# Altium project Gas_Sensor.PrjPcb
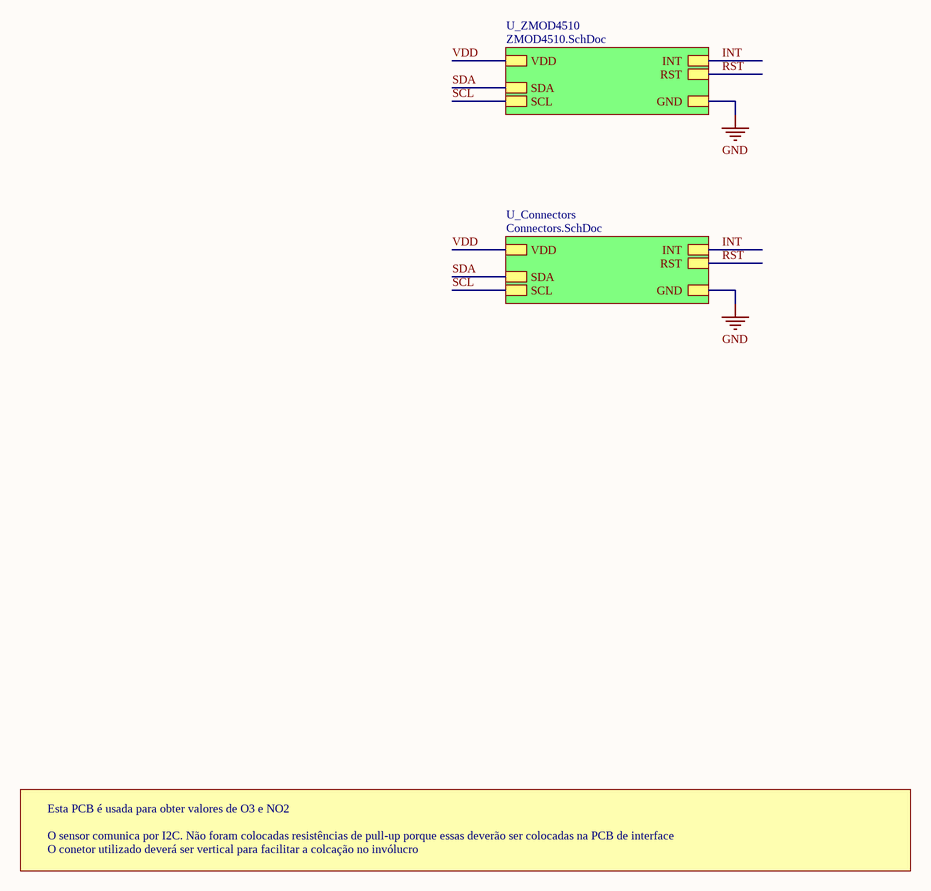
[diagram p0: Gas_Sensor.SchDoc]
3 sheets, 8 parts. Net scope: hierarchical (ports join the sheet entries above them; power ports are global).
Board file: Gas_Sensor.PcbDoc
Sheets:
  Gas_Sensor.SchDoc
    U_Connectors = Connectors.SchDoc
    U_ZMOD4510 = ZMOD4510.SchDoc

## Sheet Gas_Sensor.SchDoc: Gas Sensor Main Schematic
size A4; DrawnBy: Flávio Silva; Engineer: Flávio Silva; Organization: CeNTI; Address1: Rua Fernando Mesquita 2785; Address2: Vila Nova de Famalicão; Address3: 4760-034, Portugal; Revision: 0; SheetNumber: 1; SheetTotal: 3; Project: AM2R- Safe2Wheels

### Sub-sheets
U_Connectors = Connectors.SchDoc: VDD, SCL, SDA, INT, GND, RST
U_ZMOD4510 = ZMOD4510.SchDoc: VDD, SCL, SDA, INT, GND, RST

### Nets
GND: sheet U_Connectors/GND, sheet U_ZMOD4510/GND
INT: sheet U_Connectors/INT, sheet U_ZMOD4510/INT
RST: sheet U_Connectors/RST, sheet U_ZMOD4510/RST
SCL: sheet U_Connectors/SCL, sheet U_ZMOD4510/SCL
SDA: sheet U_Connectors/SDA, sheet U_ZMOD4510/SDA
VDD: sheet U_Connectors/VDD, sheet U_ZMOD4510/VDD

### Notes on the sheet
- Esta PCB é usada para obter valores de O3 e NO2
- O sensor comunica por I2C. Não foram colocadas resistências de pull-up porque essas deverão ser colocadas na PCB de interface
- O conetor utilizado deverá ser vertical para facilitar a colcação no invólucro
- Title:
- Project:
- Date:
- Rev:
- Sheet
- of
- Author:

## Sheet Connectors.SchDoc: Connectors
size A4; DrawnBy: Flávio Silva; Engineer: Flávio Silva; Organization: CeNTI; Address1: Rua Fernando Mesquita 2785; Address2: Vila Nova de Famalicão; Address3: 4760-034, Portugal; Revision: 0; SheetNumber: 2; SheetTotal: 3; Project: AM2R- Safe2Wheels
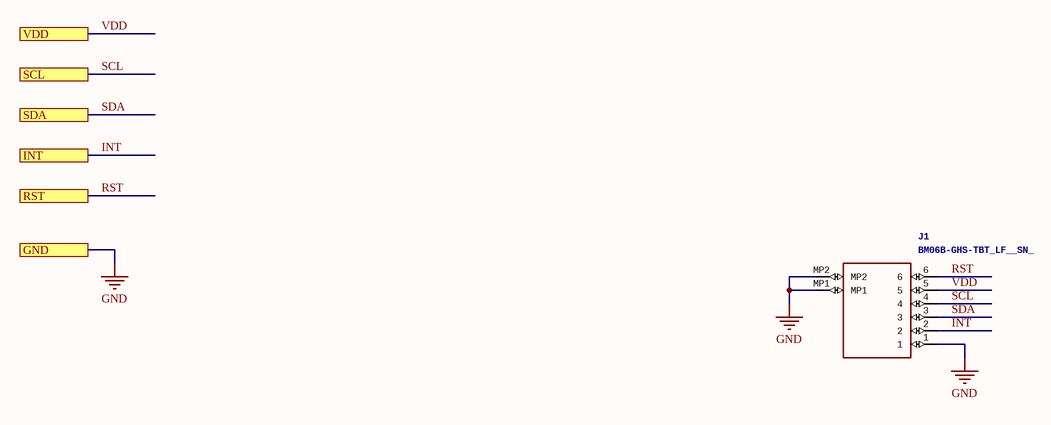
[diagram p1: Connectors.SchDoc]

### Parts
J1  BM06B-GHS-TBT_LF__SN_  [BM06BGHSTBTLFSN]

### Ports
GND, INT, RST, SCL, SDA, VDD

### Nets
GND: J1.1 J1.MP1 J1.MP2 ; port GND
INT: J1.2 ; port INT
RST: J1.6 ; port RST
SCL: J1.4 ; port SCL
SDA: J1.3 ; port SDA
VDD: J1.5 ; port VDD

### Notes on the sheet
- Title:
- Project:
- Date:
- Rev:
- Sheet
- of
- Author:

### Library data of the parts
J1 = BM06B-GHS-TBT_LF__SN_: BM06B Series 6 Position 1.25 mm Pitch Surface Mount Top Entry Shrouded Header   Source:  Datasheet; Manufacturer_Name: JST (JAPAN SOLDERLESS TERMINALS); Manufacturer_Part_Number: BM06B-GHS-TBT(LF)(SN); GateName_1: G$1; SymbolName_1: BM06B-GHS-TBT_LF__SN_; LibraryName: BM06B-GHS-TBT_LF__SN_; DeviceSetName: BM06B-GHS-TBT_LF__SN_; Height: 4.05mm

## Sheet ZMOD4510.SchDoc: ZMOD4510
size A4; DrawnBy: Flávio Silva; Engineer: Flávio Silva; Organization: CeNTI; Address1: Rua Fernando Mesquita 2785; Address2: Vila Nova de Famalicão; Address3: 4760-034, Portugal; Revision: 0; SheetNumber: 3; SheetTotal: 3; Project: AM2R- Safe2Wheels
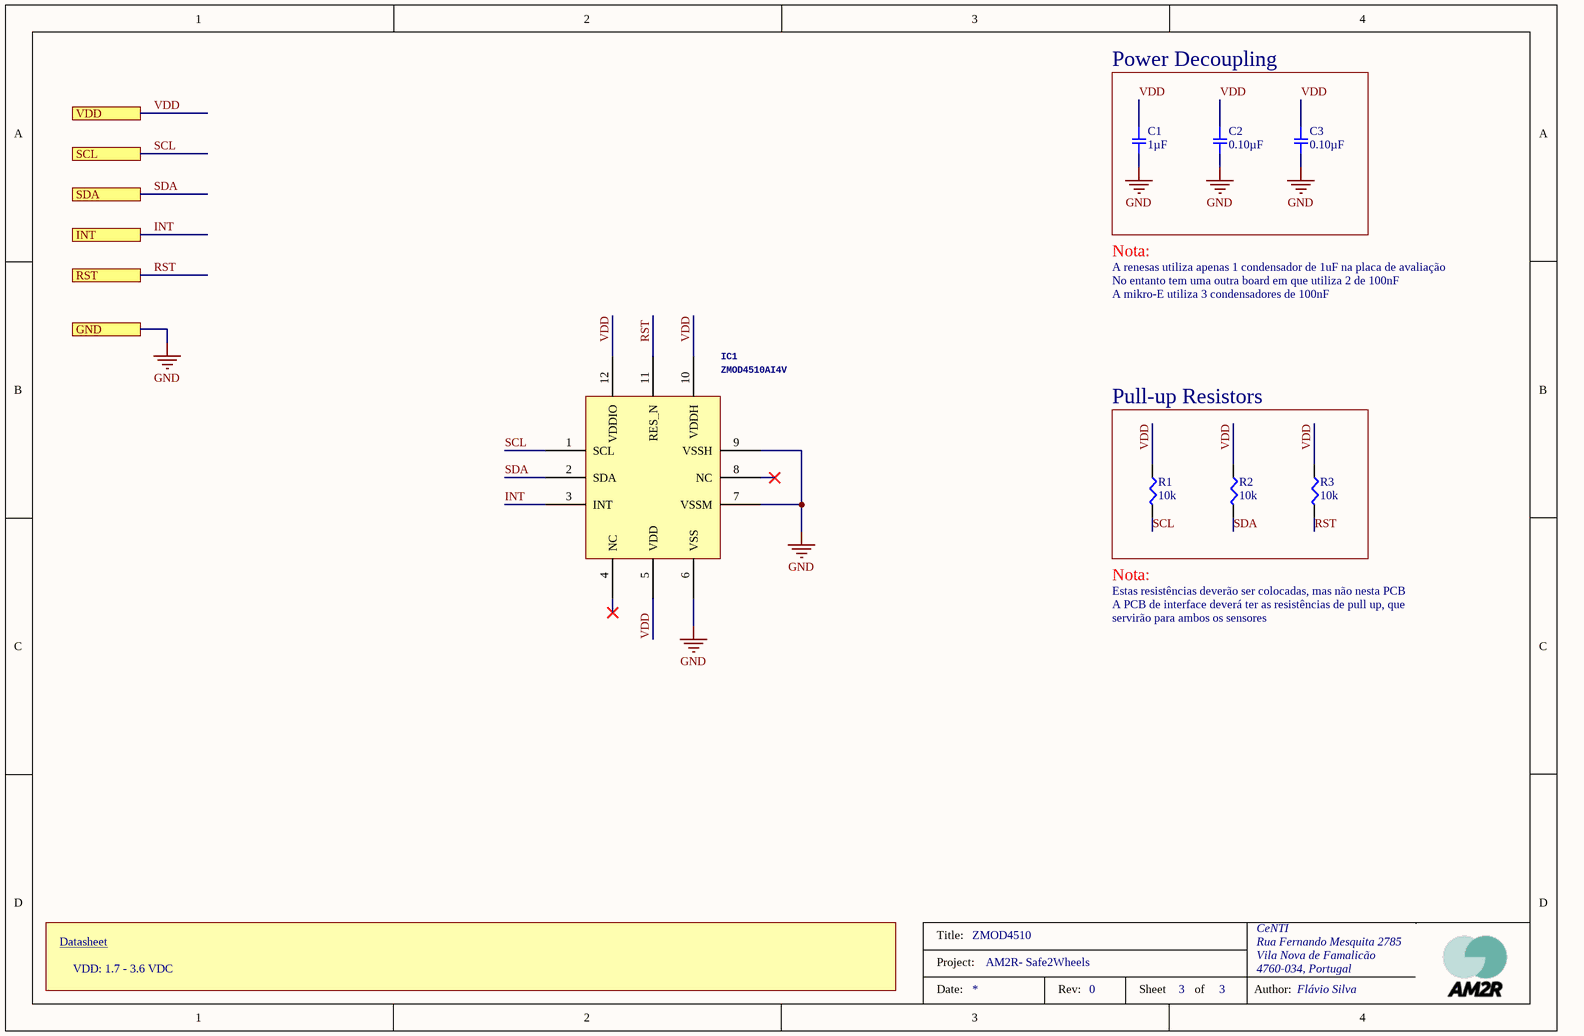
[diagram p2: ZMOD4510.SchDoc]

### Parts
C1  1µF  [SMD-0402C]
C2  0.10µF  [SMD-0402C]
C3  0.10µF  [SMD-0402C]
IC1  ZMOD4510AI4V  [ZMOD4xxx_AI4_IP67]
R1  10k  [SMD-0402-RES]
R2  10k  [SMD-0402-RES]
R3  10k  [SMD-0402-RES]

### Blocks framed on the sheet
Power Decoupling: C1-C3
Pull-up Resistors: R1-R3

### Ports
GND, INT, RST, SCL, SDA, VDD

### Nets
GND: C1.2 C2.2 C3.2 IC1.6(VSS) IC1.7(VSSM) IC1.9(VSSH) ; port GND
INT: IC1.3(INT) ; port INT
RST: IC1.11(RES_N) R3.2 ; port RST
SCL: IC1.1(SCL) R1.2 ; port SCL
SDA: IC1.2(SDA) R2.2 ; port SDA
VDD: C1.1 C2.1 C3.1 IC1.5(VDD) IC1.10(VDDH) IC1.12(VDDIO) R1.1 R2.1 R3.1 ; port VDD

Not connected (* = marked no-connect by the designer): IC1 4(NC)* 8(NC)*

### Notes on the sheet
- Nota:
- A renesas utiliza apenas 1 condensador de 1uF na placa de avaliação
- No entanto tem uma outra board em que utiliza 2 de 100nF
- A mikro-E utiliza 3 condensadores de 100nF
- Estas resistências deverão ser colocadas, mas não nesta PCB
- A PCB de interface deverá ter as resistências de pull up, que
- servirão para ambos os sensores
- Datasheet <https://www.renesas.com/us/en/document/dst/zmod4510-datasheet?r=463746>
- VDD: 1.7 - 3.6 VDC
- Title:
- Project:
- Date:
- Rev:
- Sheet
- of
- Author:

### Library data of the parts
C1 = GCM155C71A105KE38D: CAP CER 1UF 10V X7S 0402; Manufacturer: Murata Electronics North America; Factory Stock: 0; Unit Price (USD): 0.12; Minimum Quantity: 1; Tolerance: ±10%; Datasheets: http://www.murata.com/~/media/webrenewal/support/library/catalog/products/capacitor/mlcc/c03e.ashx; Image: //media.digikey.com/Renders/Murata%20Renders/ZRB-SERIES-0402.jpg; Digi-Key Part Number: 490-13409-1-ND; Part Number: GCM155C71A105KE38D; Quantity Available: 7240; @ qty: 0; Packaging: Cut Tape (CT); Series: GCM; Part Status: Active; Value: 1µF; Voltage: 10V; Temperature Coefficient: X7S; Operating Temperature: -55°C ~ 125°C; Features: -; Ratings: AEC-Q200; Applications: Automotive; Mounting Type: Surface Mount, MLCC; Package / Case: 0402 (1005 Metric); Size / Dimension: 0.039" L x 0.020" W (1.00mm x 0.50mm); Height - Seated (Max): -; Thickness (Max): 0.022" (0.55mm); Lead Spacing: -; Lead Style: -
C2 C3 = GCM155R71C104KA55D: CAP CER 0.1UF 16V X7R 0402; Manufacturer: Murata Electronics North America; Factory Stock: 0; Unit Price (USD): 0.1; Minimum Quantity: 1; Tolerance: ±10%; Datasheets: http://www.murata.com/~/media/webrenewal/support/library/catalog/products/capacitor/mlcc/c03e.ashx; Image: //media.digikey.com/Renders/Murata%20Renders/ZRB-SERIES-0402.jpg; Digi-Key Part Number: 490-4759-1-ND; Part Number: GCM155R71C104KA55D; Quantity Available: 734194; @ qty: 0; Packaging: Cut Tape (CT); Series: GCM; Part Status: Active; Value: 0.10µF; Voltage: 16V; Temperature Coefficient: X7R; Operating Temperature: -55°C ~ 125°C; Features: -; Ratings: AEC-Q200; Applications: Automotive; Mounting Type: Surface Mount, MLCC; Package / Case: 0402 (1005 Metric); Size / Dimension: 0.039" L x 0.020" W (1.00mm x 0.50mm); Height - Seated (Max): -; Thickness (Max): 0.022" (0.55mm); Lead Spacing: -; Lead Style: -
IC1 = ZMOD4510AI4V: The ZMOD4510 gas sensor platform detects air quality in a variety of indoor and outdoor applications. The module is a 12-pin LGA assembly (standard version 3.0mm x 3.0mm x 0.7mm) that consists of a gas sense element and a CMOS signal conditioning IC. The modules sense element consists of a heater element on a silicon-based MEMS structure and a metal-oxide (MOx) chemiresistor. The signal conditioner controls the sensor temperature and measures the MOx resistance, which is a function of the gas concentration   Source:  Datasheet; Manufacturer_Name: Renesas Electronics; GateName_1: G$1; SymbolName_1: ZMOD4510AI4V; LibraryName: ZMOD4510AI4V; DeviceSetName: ZMOD4510AI4V; Manufacturer_Part_Number: ZMOD4510AI4V; Mouser_Part_Number: 972-ZMOD4510AI4V; Mouser_Price-Stock: https://www.mouser.co.uk/ProductDetail/Renesas-Electronics/ZMOD4510AI4V?qs=DRkmTr78QARdQZKp0qnVWA%3D%3D; Height: 1mm
R1-R3 = ERJ-PA2F1002X: RES SMD 10K OHM 1% 1/5W 0402; Manufacturer: Panasonic Electronic Components; Factory Stock: 0; Unit Price (USD): 0.03029; @ qty: 1500; Minimum Quantity: 1; Power (Watts): 0.2W, 1/5W; Temperature Coefficient: ±100ppm/°C; Part Number: ERJ-PA2F1002X; Datasheets: https://industrial.panasonic.com/cdbs/www-data/pdf/RDA0000/AOA0000C243.pdf; Image: //media.digikey.com/Photos/Panasonic%20Photos/ERJ-PA2-Series.jpg; Digi-Key Part Number: P17230CT-ND; Quantity Available: 12292; Packaging: Cut Tape (CT); Series: ERJ; Part Status: Active; Value: 10k; Tolerance: ±1%; Composition: Thick Film; Features: Automotive AEC-Q200, Pulse Withstanding; Operating Temperature: -55°C ~ 155°C; Package / Case: 0402 (1005 Metric); Supplier Device Package: 0402; Size / Dimension: 0.039" L x 0.020" W (1.00mm x 0.50mm); Height - Seated (Max): 0.016" (0.40mm); Number of Terminations: 2; Failure Rate: -

## Nets that join several sheets
GND: Connectors (J1.1 J1.MP1 J1.MP2), ZMOD4510 (6 pins)
INT: Connectors (J1.2), ZMOD4510 (IC1.3)
RST: Connectors (J1.6), ZMOD4510 (IC1.11 R3.2)
SCL: Connectors (J1.4), ZMOD4510 (IC1.1 R1.2)
SDA: Connectors (J1.3), ZMOD4510 (IC1.2 R2.2)
VDD: Connectors (J1.5), ZMOD4510 (9 pins)